# Altium project Sensor.PrjPcb
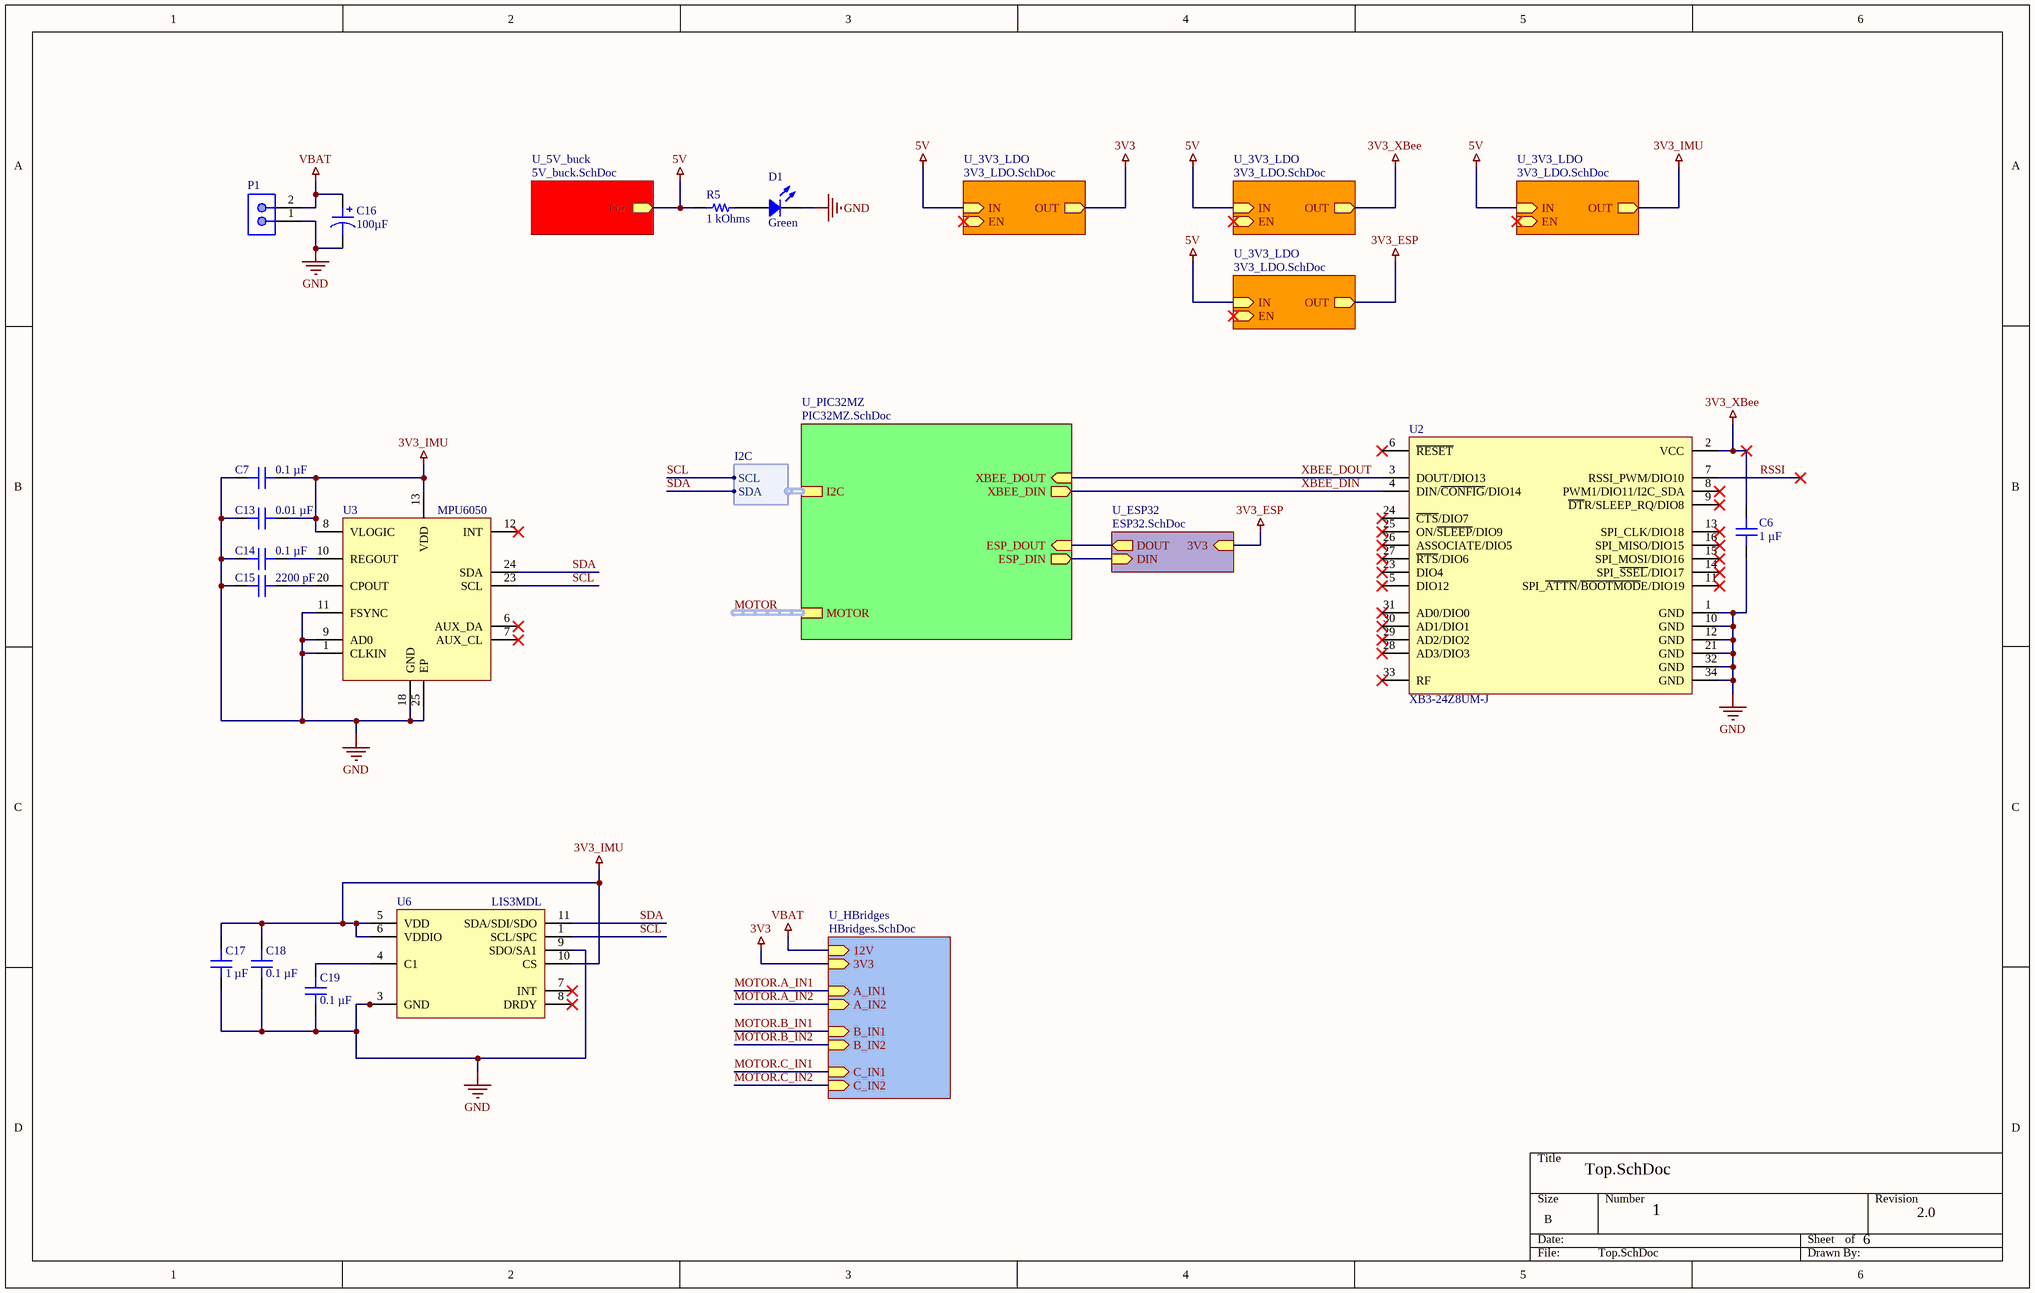
[diagram p0: Top.SchDoc]
ProjectRevision: 2.0
6 sheets, 98 parts. Net scope: hierarchical (ports join the sheet entries above them; power ports are global).
Board file: Sensor.PcbDoc
Sheets:
  Top.SchDoc
    U_PIC32MZ = PIC32MZ.SchDoc
    U_5V_buck = 5V_buck.SchDoc
    U_3V3_LDO = 3V3_LDO.SchDoc
    U_3V3_LDO = 3V3_LDO.SchDoc
    U_3V3_LDO = 3V3_LDO.SchDoc
    U_3V3_LDO = 3V3_LDO.SchDoc
    U_HBridges = HBridges.SchDoc
    U_ESP32 = ESP32.SchDoc

## Sheet Top.SchDoc
size B; SheetNumber: 1; SheetTotal: 6

### Parts
C6  1 µF  [CAP 0402_1005]
C7  0.1 µF  [CAP 0402_1005]
C13  0.01 µF  [CAP 0402_1005]
C14  0.1 µF  [CAP 0402_1005]
C15  2200 pF  [CAP 0402_1005]
C16  100µF  [CAP POL 2917_7343]
C17  1 µF  [CAP 0402_1005]
C18  0.1 µF  [CAP 0402_1005]
C19  0.1 µF  [CAP 0402_1005]
D1  Green  [LED 0603_1608 GREEN]
P1  2 pin 2mm JST Male  [2pin - 2mm JST male]  (value not drawn)
R5  1 kOhms  [YAGEO RES 0402_1005]
U2  XB3-24Z8UM-J  [XCVR_XB3-24Z8UM-J]
U3  MPU6050  [IC_MPU6050]
U6  LIS3MDL  [LGA12_ST]

### Sub-sheets
U_3V3_LDO = 3V3_LDO.SchDoc: OUT (out), IN (in), EN (in)
U_3V3_LDO = 3V3_LDO.SchDoc: OUT (out), IN (in), EN (in)
U_3V3_LDO = 3V3_LDO.SchDoc: OUT (out), IN (in), EN (in)
U_3V3_LDO = 3V3_LDO.SchDoc: OUT (out), IN (in), EN (in)
U_5V_buck = 5V_buck.SchDoc: Out (out)
U_ESP32 = ESP32.SchDoc: 3V3 (in), DOUT (out), DIN (in)
U_HBridges = HBridges.SchDoc: A_IN1 (in), A_IN2 (in), B_IN1 (in), B_IN2 (in), C_IN1 (in), C_IN2 (in), 3V3 (in), 12V (in)
U_PIC32MZ = PIC32MZ.SchDoc: XBEE_DIN (out), XBEE_DOUT (in), I2C (harness I2C), MOTOR (harness MOTOR), ESP_DIN (out), ESP_DOUT (in)

### Harnesses
I2C: SCL, SDA

### Nets
3V3: sheet U_3V3_LDO/OUT, sheet U_HBridges/3V3
3V3_ESP: sheet U_3V3_LDO/OUT, sheet U_ESP32/3V3
3V3_IMU: C7.1 C13.1 C17.1 C18.1 U3.8(VLOGIC) U3.13(VDD) U6.5(VDD) U6.6(VDDIO) U6.10(CS) ; sheet U_3V3_LDO/OUT
3V3_XBee: C6.1 U2.2(VCC) ; sheet U_3V3_LDO/OUT
5V: R5.1 ; sheet U_5V_buck/Out, sheet U_3V3_LDO/IN, sheet U_3V3_LDO/IN, sheet U_3V3_LDO/IN, sheet U_3V3_LDO/IN
GND: C6.2 C7.2 C13.2 C14.2 C15.2 C16.2 C17.2 C18.2 C19.2 D1.2 P1.1 U2.1(GND) U2.10(GND) U2.12(GND) U2.21(GND) U2.32(GND) U2.34(GND) U3.1(CLKIN) U3.9(AD0) U3.11(FSYNC) U3.18(GND) U3.25(EP) U6.2(Reserved) U6.3(GND) U6.9(SDO/SA1) U6.12(Reserved)
VBAT: C16.1 P1.2 ; sheet U_HBridges/12V
ESP_DIN: sheet U_PIC32MZ/ESP_DIN, sheet U_ESP32/DIN
ESP_DOUT: sheet U_PIC32MZ/ESP_DOUT, sheet U_ESP32/DOUT
RSSI: U2.7(RSSI_PWM/DIO10)
SCL: U3.23(SCL) U6.1(SCL/SPC) ; sheet U_PIC32MZ/I2C.SCL
SDA: U3.24(SDA) U6.11(SDA/SDI/SDO) ; sheet U_PIC32MZ/I2C.SDA
XBEE_DIN: U2.4(DIN/~{CONFIG}/DIO14) ; sheet U_PIC32MZ/XBEE_DIN
XBEE_DOUT: U2.3(DOUT/DIO13) ; sheet U_PIC32MZ/XBEE_DOUT
NetC14_1: C14.1 U3.10(REGOUT)
NetC15_1: C15.1 U3.20(CPOUT)
NetC19_1: C19.1 U6.4(C1)
NetD1_1: D1.1 R5.2

Not connected (* = marked no-connect by the designer): U2 5(DIO12)* 6(~{RESET})* 8(PWM1/DIO11/I2C_SDA)* 9(~{DT}R/SLEEP_RQ/DIO8)* 11(SPI_~{ATTN}/~{BOOTMOD}E/DIO19)* 13(SPI_CLK/DIO18)* 14(SPI_~{SSEL}/DIO17)* 15(SPI_MOSI/DIO16)* 16(SPI_MISO/DIO15)* 23(DIO4)* 24(~{CTS}/DIO7)* 25(ON/~{SLEEP}/DIO9)* 26(ASSOCIATE/DIO5)* 27(~{RTS}/DIO6)* 28(AD3/DIO3)* 29(AD2/DIO2)* 30(AD1/DIO1)* 31(AD0/DIO0)* 33(RF)*; U3 6(AUX_DA)* 7(AUX_CL)* 12(INT)*; U6 7(INT)* 8(DRDY)*

### Buses and harness runs
harness MOTOR = sheet U_PIC32MZ/MOTOR

### Library data of the parts
C6 C13 C15 C17 = C0402C104K4RACAUTO: CAP CER 0.1UF 16V X7R 0402; manufacturer: KEMET; Capacitance: 0.1 µF; Tolerance: ±10%; Part Number: C0402C104K4RACAUTO; Applications: Automotive, Bypass, Decoupling; componentlink1description: Datasheet; componentlink1url: https://api.kemet.com/component-edge/download/specsheet/C0402C104K4RACAUTO.pdf; componentlink2description: DigiKey Link; componentlink2url: https://www.digikey.com/en/products/detail/kemet/C0402C104K4RACAUTO/3314827; Device Package: 0402 (1005 Metric); lastupdated: 8/14/2022 9:05:51 PM; Lifecycle Status: Active; Minimum Order: 1; Mounting Type: Surface Mount, MLCC; Operating Temperature: -55°C ~ 125°C; Package / Case: 0402 (1005 Metric); packaging: TapeAndReel; partid: 3024; Part Status: Active; price: 0.01; Ratings: AEC-Q200; series: SMD Auto X7R; Size / Dimension: 0.039" L x 0.020" W (1.00mm x 0.50mm); Supplier 1: DigiKey; Supplier Part Number 1: 399-6828-1-ND; Temperature Coefficient: X7R; Thickness (Max): 0.022" (0.55mm); Voltage - Rated: 16V
  C6 C17: Value: 1 µF
  C13: Value: 0.01 µF
  C15: Value: 2200 pF
C7 C14 C18 C19 = C0402C104K4RACAUTO: CAP CER 0.1UF 16V X7R 0402; manufacturer: KEMET; Tolerance: ±10%; Part Number: C0402C104K4RACAUTO; Value: 0.1 µF; Applications: Automotive, Bypass, Decoupling; Capacitance: 0.1 µF; componentlink1description: Datasheet; componentlink1url: https://api.kemet.com/component-edge/download/specsheet/C0402C104K4RACAUTO.pdf; componentlink2description: DigiKey Link; componentlink2url: https://www.digikey.com/en/products/detail/kemet/C0402C104K4RACAUTO/3314827; Device Package: 0402 (1005 Metric); lastupdated: 8/14/2022 9:05:51 PM; Lifecycle Status: Active; Minimum Order: 1; Mounting Type: Surface Mount, MLCC; Operating Temperature: -55°C ~ 125°C; Package / Case: 0402 (1005 Metric); packaging: TapeAndReel; partid: 3024; Part Status: Active; price: 0.01; Ratings: AEC-Q200; series: SMD Auto X7R; Size / Dimension: 0.039" L x 0.020" W (1.00mm x 0.50mm); Supplier 1: DigiKey; Supplier Part Number 1: 399-6828-1-ND; Temperature Coefficient: X7R; Thickness (Max): 0.022" (0.55mm); Voltage - Rated: 16V
C16 = 293D107X0020E2TE3: CAP TANT 100UF 20% 20V 2917; Manufacturer: Vishay Sprague; Manufacturer Size Code: E; ESR (Equivalent Series Resistance): 500mOhm; Type: Molded; Part Number: 293D107X0020E2TE3; Value: 100µF; Capacitance: 100µF; ComponentLink1Description: Datasheet; ComponentLink1URL: http://www.vishay.com/docs/40002/293d.pdf; ComponentLink2Description: DigiKey Link; ComponentLink2URL: http://digikey.com/product-detail/en/vishay-sprague/293D107X0020E2TE3/718-293D107X0020E2TE3CT-ND/10507022; Device Package: 2917 (7343 Metric); Features: General Purpose; Height - Seated (Max): 0.170" (4.32mm); LastUpdated: 13-Aug-20 10:43:35 AM; Lifecycle Status: Active; Minimum Order: 1; Mounting Type: Surface Mount; Operating Temperature: -55°C ~ 125°C; Package / Case: 2917 (7343 Metric); Packaging: TapeAndReel; PartId: 1360; Part Status: Active; Price: 0.70; Series: TANTAMOUNT®, 293D; Size / Dimension: 0.287" L x 0.169" W (7.30mm x 4.30mm); Supplier 1: DigiKey; Supplier Part Number 1: 718-293D107X0020E2TE3CT-ND; Tolerance: ±20%
D1 = XZCDGK53W-8VF: 1.6X0.8MM LC GREEN PIXSOLED DOME; Manufacturer: SunLED; Configuration: Independent; Current - Test: 2mA; Lens Color: Colorless; Lens Size: 0.35mm Dia; Lens Style: Round with Domed Top; Lens Transparency: Clear; Millicandela Rating: 417mcd; Viewing Angle: 60°; Voltage - Forward (Vf) (Typ): 2.65V; Wavelength - Dominant: 525nm; Wavelength - Peak: 515nm; Part Number: XZCDGK53W-8VF; Color: Green; ComponentLink1Description: Datasheet; ComponentLink1URL: https://www.sunledusa.com/products/spec/XZCDGK53W-8VF.pdf; ComponentLink2Description: DigiKey Link; ComponentLink2URL: http://digikey.com/product-detail/en/sunled/XZCDGK53W-8VF/1497-XZCDGK53W-8VFCT-ND/10449792; Device Package: 0603 (1608 Metric); Height (Max): 1.10mm; LastUpdated: 21-Jan-20 3:12:09 AM; Lifecycle Status: Active; Minimum Order: 1; Mounting Type: Surface Mount; Package / Case: 0603 (1608 Metric); Packaging: Unknown; PartId: 938; Part Status: Active; Price: 0.18; Series: Ultra Low Current; Size / Dimension: 1.60mm L x 0.80mm W; Supplier 1: DigiKey; Supplier Part Number 1: 1497-XZCDGK53W-8VFCT-ND; Supplier Device Package: 2-SMD; Value: Green
R5 = RC0402FR-071KL: RES 1K OHM 1% 1/16W 0402; Manufacturer: Yageo; Power (Watts): 0.063W, 1/16W; Temperature Coefficient: ±100ppm/°C; Part Number: RC0402FR-071KL; Value: 1 kOhms; ComponentLink1Description: Datasheet; ComponentLink1URL: https://www.yageo.com/upload/media/product/productsearch/datasheet/rchip/PYu-RC_Group_51_RoHS_L_10.pdf; ComponentLink2Description: DigiKey Link; ComponentLink2URL: https://www.digikey.com/en/products/detail/yageo/RC0402FR-071KL/726513; Composition: Thick Film; Device Package: 0402 (1005 Metric); Features: Moisture Resistant; Height - Seated (Max): 0.016" (0.40mm); LastUpdated: 7/25/2024 9:18:11 AM; Lifecycle Status: Active; Minimum Order: 1; Number of Terminations: 2; Operating Temperature: -55°C ~ 155°C; Package / Case: 0402 (1005 Metric); Packaging: CutTape; PartId: 17596; Part Status: Active; Price: 0.01; Resistance: 1 kOhms; Series: RC_L; Size / Dimension: 0.039" L x 0.020" W (1.00mm x 0.50mm); Supplier 1: DigiKey; Supplier Part Number 1: 311-1.00KLRCT-ND; Supplier Device Package: 0402; Tolerance: ±1%
U2 = XB3-24Z8UM-J: 802.15.4 Zigbee Transceiver Module 2.4GHz Antenna Not Included, U.FL Surface Mount; MF: Digi International; Availability: Unavailable; MP: XB3-24Z8UM-J; Value: *; SnapEDA_Link: https://www.snapeda.com/parts/XB3-24Z8UM-J/Digi%20International/view-part/2762908/?ref=snap; Price: None; Package: SMD-34 Digi International
U6 = LIS3MDL: Magnetometer

## Sheet PIC32MZ.SchDoc
size B; DocumentNumber: 6; SheetNumber: 2; SheetTotal: 7
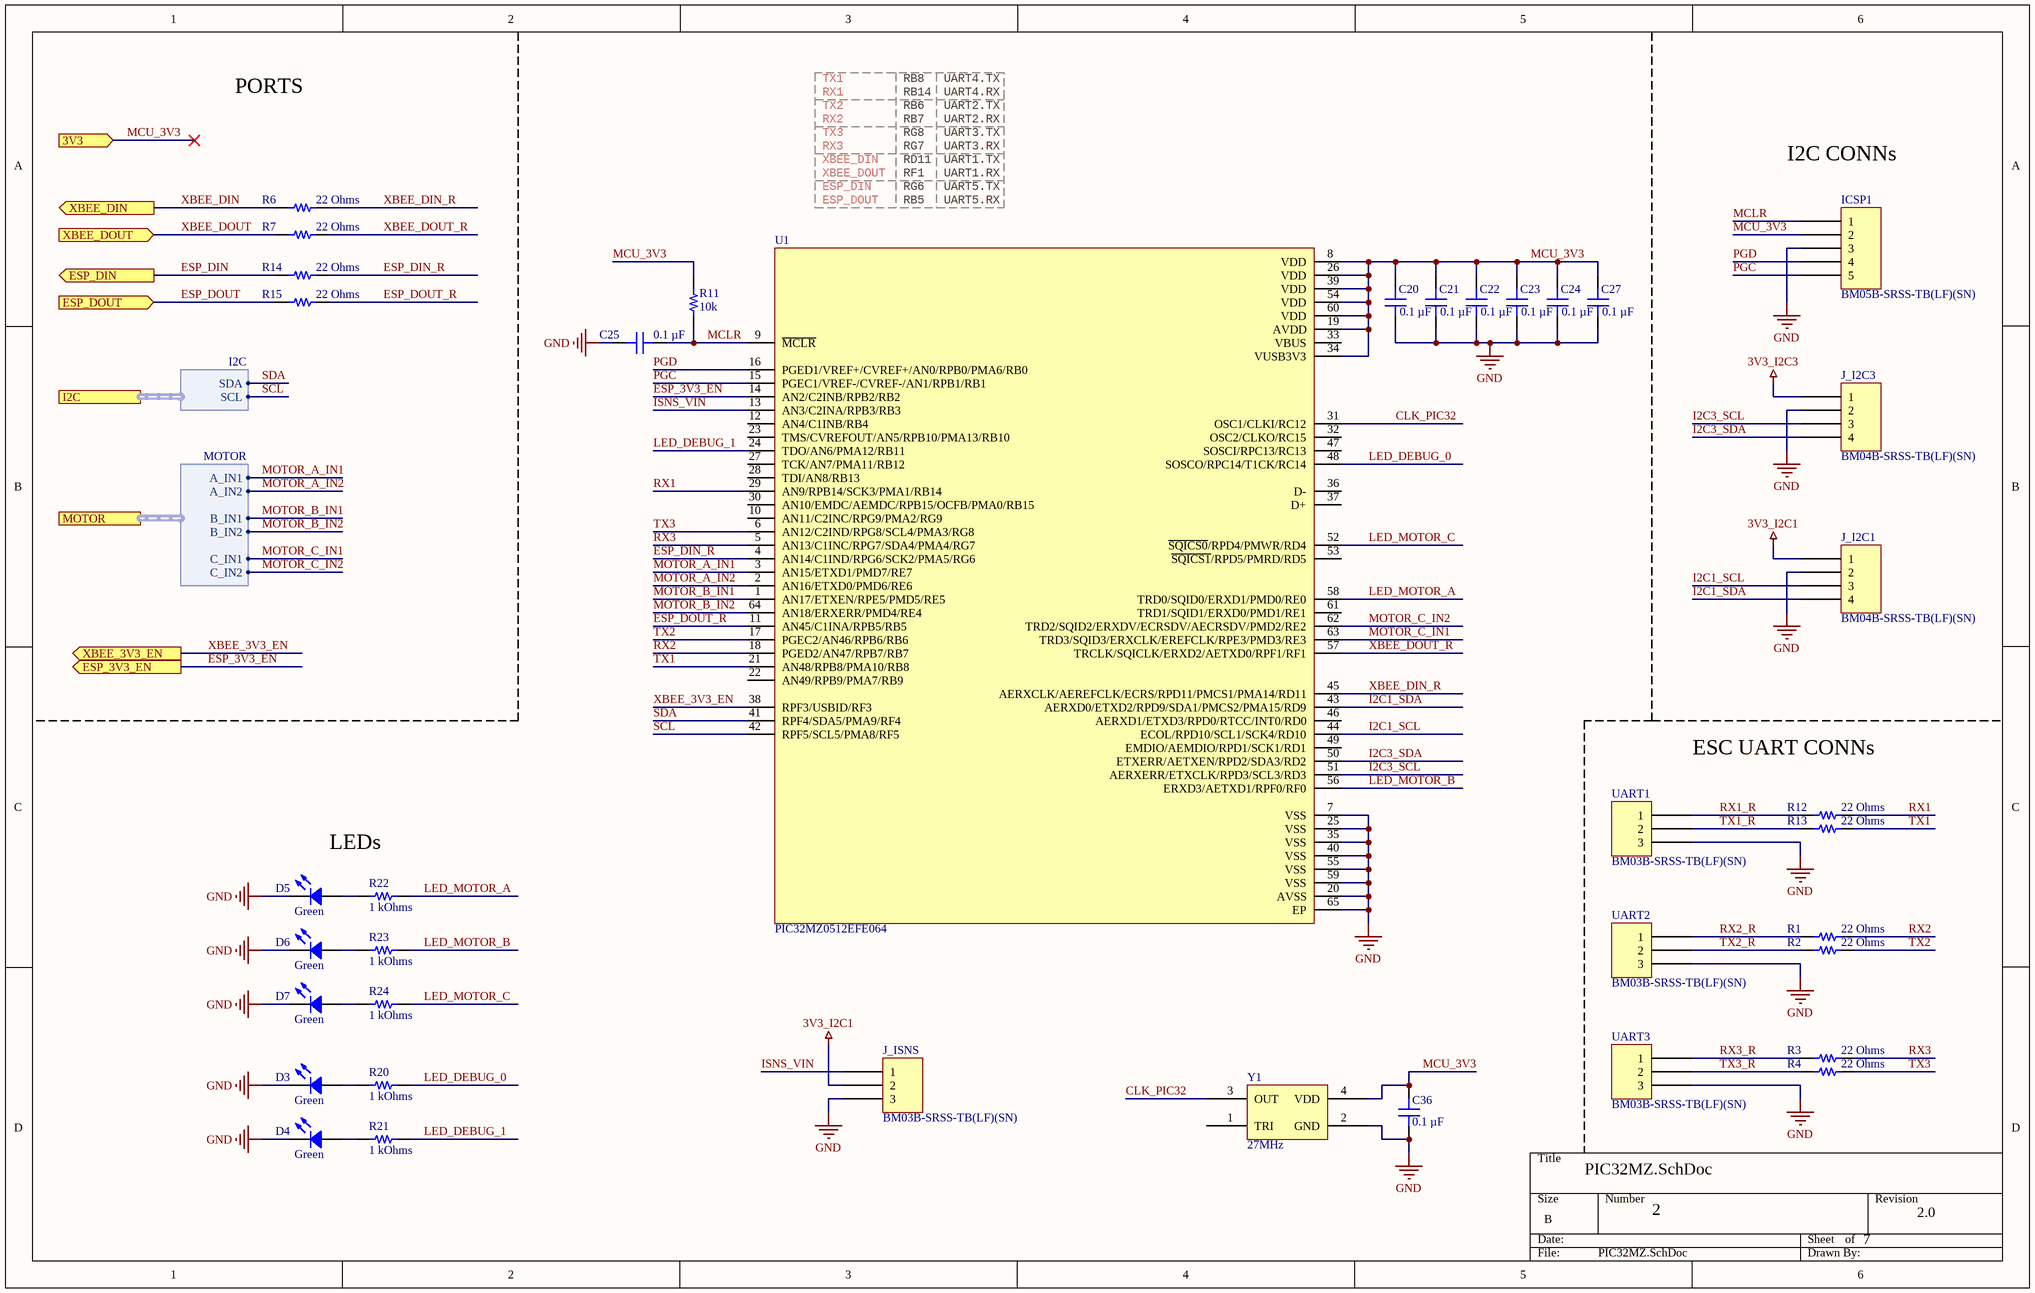
[diagram p1: PIC32MZ.SchDoc]

### Parts
C20  0.1 µF  [CAP 0402_1005]
C21  0.1 µF  [CAP 0402_1005]
C22  0.1 µF  [CAP 0402_1005]
C23  0.1 µF  [CAP 0402_1005]
C24  0.1 µF  [CAP 0402_1005]
C25  0.1 µF  [CAP 0402_1005]
C27  0.1 µF  [CAP 0402_1005]
C36  0.1 µF  [CAP 0402_1005]
D3  Green  [LED 0603_1608 GREEN]
D4  Green  [LED 0603_1608 GREEN]
D5  Green  [LED 0603_1608 GREEN]
D6  Green  [LED 0603_1608 GREEN]
D7  Green  [LED 0603_1608 GREEN]
ICSP1  BM05B-SRSS-TB(LF)(SN)  [JST BM05B-SRSS-TB]
J_I2C1  BM04B-SRSS-TB(LF)(SN)  [JST BM04B-SRSS-TB]
J_I2C3  BM04B-SRSS-TB(LF)(SN)  [JST BM04B-SRSS-TB]
J_ISNS  BM03B-SRSS-TB(LF)(SN)  [JST BM03B-SRSS-TB]
R1  22 Ohms  [RES 0402_1005]
R2  22 Ohms  [RES 0402_1005]
R3  22 Ohms  [RES 0402_1005]
R4  22 Ohms  [RES 0402_1005]
R6  22 Ohms  [RES 0402_1005]
R7  22 Ohms  [RES 0402_1005]
R11  10k  [RES 0402_1005]
R12  22 Ohms  [RES 0402_1005]
R13  22 Ohms  [RES 0402_1005]
R14  22 Ohms  [YAGEO RES 0402_1005]
R15  22 Ohms  [YAGEO RES 0402_1005]
R20  1 kOhms  [YAGEO RES 0402_1005]
R21  1 kOhms  [YAGEO RES 0402_1005]
R22  1 kOhms  [YAGEO RES 0402_1005]
R23  1 kOhms  [YAGEO RES 0402_1005]
R24  1 kOhms  [YAGEO RES 0402_1005]
U1  PIC32MZ0512EFE064  [QFN50P900X900X100-65N]
UART1  BM03B-SRSS-TB(LF)(SN)  [JST BM03B-SRSS-TB]
UART2  BM03B-SRSS-TB(LF)(SN)  [JST BM03B-SRSS-TB]
UART3  BM03B-SRSS-TB(LF)(SN)  [JST BM03B-SRSS-TB]
Y1  27MHz  [ABRACON ASD]

### Ports
3V3 (in), ESP_3V3_EN (out), ESP_DIN (out), ESP_DOUT (in), I2C (harness I2C), MOTOR (harness MOTOR), XBEE_3V3_EN (out), XBEE_DIN (out), XBEE_DOUT (in)

### Harnesses
I2C: SDA, SCL
MOTOR: A_IN1, A_IN2, B_IN1, B_IN2, C_IN1, C_IN2

### Nets
3V3_I2C1: J_I2C1.1 J_ISNS.2
3V3_I2C3: J_I2C3.1
GND: C20.1 C21.1 C22.1 C23.1 C24.1 C25.2 C27.1 C36.1 D3.2 D4.2 D5.2 D6.2 D7.2 ICSP1.3 J_I2C1.2 J_I2C3.2 J_ISNS.3 U1.7(VSS) U1.20(AVSS) U1.25(VSS) U1.35(VSS) U1.40(VSS) U1.55(VSS) U1.59(VSS) U1.65(EP) UART1.3 UART2.3 UART3.3 Y1.2(GND)
CLK_PIC32: U1.31(OSC1/CLKI/RC12) Y1.3(OUT)
ESP_3V3_EN: U1.14(AN2/C2INB/RPB2/RB2) ; port ESP_3V3_EN
ESP_DIN: R14.1 ; port ESP_DIN
ESP_DIN_R: R14.2 U1.4(AN14/C1IND/RPG6/SCK2/PMA5/RG6)
ESP_DOUT: R15.1 ; port ESP_DOUT
ESP_DOUT_R: R15.2 U1.11(AN45/C1INA/RPB5/RB5)
I2C1_SCL: J_I2C1.3 U1.44(ECOL/RPD10/SCL1/SCK4/RD10)
I2C1_SDA: J_I2C1.4 U1.43(AERXD0/ETXD2/RPD9/SDA1/PMCS2/PMA15/RD9)
I2C3_SCL: J_I2C3.3 U1.51(AERXERR/ETXCLK/RPD3/SCL3/RD3)
I2C3_SDA: J_I2C3.4 U1.50(ETXERR/AETXEN/RPD2/SDA3/RD2)
ISNS_VIN: J_ISNS.1 U1.13(AN3/C2INA/RPB3/RB3)
LED_DEBUG_0: R20.2 U1.48(SOSCO/RPC14/T1CK/RC14)
LED_DEBUG_1: R21.2 U1.24(TDO/AN6/PMA12/RB11)
LED_MOTOR_A: R22.2 U1.58(TRD0/SQID0/ERXD1/PMD0/RE0)
LED_MOTOR_B: R23.2 U1.56(ERXD3/AETXD1/RPF0/RF0)
LED_MOTOR_C: R24.2 U1.52(~{SQICS0}/RPD4/PMWR/RD4)
MCLR: C25.1 ICSP1.1 R11.2 U1.9(~{MCLR})
MCU_3V3: C20.2 C21.2 C22.2 C23.2 C24.2 C27.2 C36.2 ICSP1.2 R11.1 U1.8(VDD) U1.19(AVDD) U1.26(VDD) U1.34(VUSB3V3) U1.39(VDD) U1.54(VDD) U1.60(VDD) Y1.4(VDD) ; port 3V3
MOTOR_A_IN1: U1.3(AN15/ETXD1/PMD7/RE7) ; port MOTOR.A_IN1  [project net MOTOR.A_IN1]
MOTOR_A_IN2: U1.2(AN16/ETXD0/PMD6/RE6) ; port MOTOR.A_IN2  [project net MOTOR.A_IN2]
MOTOR_B_IN1: U1.1(AN17/ETXEN/RPE5/PMD5/RE5) ; port MOTOR.B_IN1  [project net MOTOR.B_IN1]
MOTOR_B_IN2: U1.64(AN18/ERXERR/PMD4/RE4) ; port MOTOR.B_IN2  [project net MOTOR.B_IN2]
MOTOR_C_IN1: U1.63(TRD3/SQID3/ERXCLK/EREFCLK/RPE3/PMD3/RE3) ; port MOTOR.C_IN1  [project net MOTOR.C_IN1]
MOTOR_C_IN2: U1.62(TRD2/SQID2/ERXDV/ECRSDV/AECRSDV/PMD2/RE2) ; port MOTOR.C_IN2  [project net MOTOR.C_IN2]
PGC: ICSP1.5 U1.15(PGEC1/VREF-/CVREF-/AN1/RPB1/RB1)
PGD: ICSP1.4 U1.16(PGED1/VREF+/CVREF+/AN0/RPB0/PMA6/RB0)
RX1: R12.1 U1.29(AN9/RPB14/SCK3/PMA1/RB14)
RX1_R: R12.2 UART1.1
RX2: R1.1 U1.18(PGED2/AN47/RPB7/RB7)
RX2_R: R1.2 UART2.1
RX3: R3.1 U1.5(AN13/C1INC/RPG7/SDA4/PMA4/RG7)
RX3_R: R3.2 UART3.1
SCL: U1.42(RPF5/SCL5/PMA8/RF5) ; port I2C.SCL
SDA: U1.41(RPF4/SDA5/PMA9/RF4) ; port I2C.SDA
TX1: R13.1 U1.21(AN48/RPB8/PMA10/RB8)
TX1_R: R13.2 UART1.2
TX2: R2.1 U1.17(PGEC2/AN46/RPB6/RB6)
TX2_R: R2.2 UART2.2
TX3: R4.1 U1.6(AN12/C2IND/RPG8/SCL4/PMA3/RG8)
TX3_R: R4.2 UART3.2
XBEE_3V3_EN: U1.38(RPF3/USBID/RF3) ; port XBEE_3V3_EN
XBEE_DIN: R6.2 ; port XBEE_DIN
XBEE_DIN_R: R6.1 U1.45(AERXCLK/AEREFCLK/ECRS/RPD11/PMCS1/PMA14/RD11)
XBEE_DOUT: R7.2 ; port XBEE_DOUT
XBEE_DOUT_R: R7.1 U1.57(TRCLK/SQICLK/ERXD2/AETXD0/RPF1/RF1)
NetD3_1: D3.1 R20.1
NetD4_1: D4.1 R21.1
NetD5_1: D5.1 R22.1
NetD6_1: D6.1 R23.1
NetD7_1: D7.1 R24.1

Not connected (* = marked no-connect by the designer): U1 10(AN11/C2INC/RPG9/PMA2/RG9) 12(AN4/C1INB/RB4) 22(AN49/RPB9/PMA7/RB9) 23(TMS/CVREFOUT/AN5/RPB10/PMA13/RB10) 27(TCK/AN7/PMA11/RB12) 28(TDI/AN8/RB13) 30(AN10/EMDC/AEMDC/RPB15/OCFB/PMA0/RB15) 32(OSC2/CLKO/RC15) 33(VBUS) 36(D-) 37(D+) 46(AERXD1/ETXD3/RPD0/RTCC/INT0/RD0) 47(SOSCI/RPC13/RC13) 49(EMDIO/AEMDIO/RPD1/SCK1/RD1) 53(~{SQICS1}/RPD5/PMRD/RD5) 61(TRD1/SQID1/ERXD0/PMD1/RE1); Y1 1(TRI)

### Notes on the sheet
- PORTS
- TX1
- RX1
- RB8
- RB14
- UART4.TX
- UART4.RX
- TX2
- RX2
- TX3
- RX3
- XBEE_DIN
- RB6
- RB7
- RG8
- RG7
- RD11
- UART2.TX
- UART3.TX
- UART1.TX
- UART2.RX
- UART3.RX
- I2C CONNs
- XBEE_DOUT
- ESP_DIN
- ESP_DOUT
- RF1
- RB5
- RG6
- UART5.TX
- UART1.RX
- UART5.RX
- ESC UART CONNs
- LEDs

### Library data of the parts
C20-C25 C27 C36 = C0402C104K4RACAUTO: as C7 on sheet Top; Part Number: C0402C104K4RACAUTO; Value: 0.1 µF; Applications: Automotive, Bypass, Decoupling; Capacitance: 0.1 µF; componentlink1description: Datasheet; componentlink1url: https://api.kemet.com/component-edge/download/specsheet/C0402C104K4RACAUTO.pdf; componentlink2description: DigiKey Link; componentlink2url: https://www.digikey.com/en/products/detail/kemet/C0402C104K4RACAUTO/3314827; Device Package: 0402 (1005 Metric); Lifecycle Status: Active; Minimum Order: 1; Mounting Type: Surface Mount, MLCC; Operating Temperature: -55°C ~ 125°C; Package / Case: 0402 (1005 Metric); packaging: TapeAndReel; partid: 3024; Part Status: Active; price: 0.01; Ratings: AEC-Q200; series: SMD Auto X7R; Size / Dimension: 0.039" L x 0.020" W (1.00mm x 0.50mm); Supplier 1: DigiKey; Supplier Part Number 1: 399-6828-1-ND; Temperature Coefficient: X7R; Thickness (Max): 0.022" (0.55mm); Voltage - Rated: 16V
  C20-C25 C27: lastupdated: 8/14/2022 9:05:51 PM
  C36: lastupdated: 2/9/2024 8:04:35 PM
D3-D7 = XZCDGK53W-8VF: as D1 on sheet Top; Part Number: XZCDGK53W-8VF; Color: Green; ComponentLink1Description: Datasheet; ComponentLink1URL: https://www.sunledusa.com/products/spec/XZCDGK53W-8VF.pdf; ComponentLink2Description: DigiKey Link; ComponentLink2URL: http://digikey.com/product-detail/en/sunled/XZCDGK53W-8VF/1497-XZCDGK53W-8VFCT-ND/10449792; Device Package: 0603 (1608 Metric); Height (Max): 1.10mm; LastUpdated: 21-Jan-20 3:12:09 AM; Lifecycle Status: Active; Minimum Order: 1; Mounting Type: Surface Mount; Package / Case: 0603 (1608 Metric); Packaging: Unknown; PartId: 938; Part Status: Active; Price: 0.18; Series: Ultra Low Current; Size / Dimension: 1.60mm L x 0.80mm W; Supplier 1: DigiKey; Supplier Part Number 1: 1497-XZCDGK53W-8VFCT-ND; Supplier Device Package: 2-SMD; Value: Green
ICSP1 = BM05B-SRSS-TB(LF)(SN): CONN HEADER SMD 5POS 1MM; Manufacturer: JST Sales America Inc.; Current Rating (Amps): 0.7A; Material Flammability Rating: UL94 V-0; Number of Positions: 5; Number of Positions Loaded: All; Pitch - Mating: 0.039" (1.00mm); Shrouding: Shrouded - 4 Wall; Style: Board to Cable/Wire; Voltage Rating: 50V; Part Number: BM05B-SRSS-TB(LF)(SN); ComponentLink1Description: Datasheet; ComponentLink1URL: http://www.jst-mfg.com/product/pdf/eng/eSR.pdf; ComponentLink2Description: DigiKey Link; ComponentLink2URL: http://digikey.com/product-detail/en/jst-sales-america-inc/BM05B-SRSS-TB-LF-SN/455-1791-1-ND/926862; Connector Type: Header; Contact Finish - Mating: Tin; Contact Finish - Post: Tin; Contact Material: Copper Alloy; Contact Shape: Square; Contact Type: Male Pin; Fastening Type: Push-Pull; Features: Solder Retention; Insulation Color: Natural; Insulation Height: 0.167" (4.25mm); Insulation Material: Polyamide (PA), Nylon; LastUpdated: 1/12/2020 10:14:00 PM; Lifecycle Status: Active; Minimum Order: 1; Mounting Type: Surface Mount; Number of Rows: 1; Operating Temperature: -25°C ~ 85°C; Packaging: TapeAndReel; PartId: 18; Part Status: Active; Price: 0.35; Series: SR; Supplier 1: DigiKey; Supplier Part Number 1: 455-1791-1-ND; Termination: Solder
J_I2C1 J_I2C3 = BM04B-SRSS-TB(LF)(SN): CONN HEADER SMD 4POS 1MM; Manufacturer: JST Sales America Inc.; Current Rating (Amps): 0.7A; Material Flammability Rating: UL94 V-0; Number of Positions: 4; Number of Positions Loaded: All; Pitch - Mating: 0.039" (1.00mm); Row Spacing - Mating: -25°C ~ 85°C; Shrouding: Shrouded - 4 Wall; Style: Board to Cable/Wire; Voltage Rating: 50V; Part Number: BM04B-SRSS-TB(LF)(SN); ComponentLink1Description: Datasheet; ComponentLink1URL: http://www.jst-mfg.com/product/pdf/eng/eSH.pdf; ComponentLink2Description: DigiKey Link; ComponentLink2URL: http://digikey.com/product-detail/en/jst-sales-america-inc/BM04B-SRSS-TB-LF-SN/455-1790-1-ND/926861; Connector Type: Header; Contact Finish - Mating: Tin; Contact Finish - Post: Tin; Contact Material: Copper Alloy; Contact Shape: Square; Contact Type: Male Pin; Fastening Type: Push-Pull; Features: Solder Retention; Insulation Color: Natural; Insulation Height: 0.167" (4.25mm); Insulation Material: Polyamide (PA), Nylon; LastUpdated: 8/24/2020 1:45:53 PM; Lifecycle Status: Active; Minimum Order: 1; Mounting Type: Surface Mount; Number of Rows: 1; Operating Temperature: -25°C ~ 85°C; Packaging: TapeAndReel; PartId: 16; Part Status: Active; Price: 0.29; Series: SR; Supplier 1: DigiKey; Supplier Part Number 1: 455-1790-1-ND; Termination: Solder
J_ISNS UART1-UART3 = BM03B-SRSS-TB(LF)(SN): CONN HEADER SMD 3POS 1MM; Manufacturer: JST Sales America Inc.; Current Rating (Amps): 0.7A; Material Flammability Rating: UL94 V-0; Number of Positions: 3; Number of Positions Loaded: All; Pitch - Mating: 0.039" (1.00mm); Shrouding: Shrouded - 4 Wall; Style: Board to Cable/Wire; Voltage Rating: 50V; Part Number: BM03B-SRSS-TB(LF)(SN); ComponentLink1Description: Datasheet; ComponentLink1URL: http://www.jst-mfg.com/product/pdf/eng/eSR.pdf; ComponentLink2Description: DigiKey Link; ComponentLink2URL: http://digikey.com/product-detail/en/jst-sales-america-inc/BM03B-SRSS-TB-LF-SN/455-1789-1-ND/926860; Connector Type: Header; Contact Finish - Mating: Tin; Contact Finish - Post: Tin; Contact Material: Copper Alloy; Contact Shape: Square; Contact Type: Male Pin; Fastening Type: Push-Pull; Features: Solder Retention; Insulation Color: Natural; Insulation Height: 0.167" (4.25mm); Insulation Material: Polyamide (PA), Nylon; LastUpdated: 1/12/2020 10:12:14 PM; Lifecycle Status: Active; Minimum Order: 1; Mounting Type: Surface Mount; Number of Rows: 1; Operating Temperature: -25°C ~ 85°C; Packaging: TapeAndReel; PartId: 14; Part Status: Active; Price: 0.24; Series: SR; Supplier 1: DigiKey; Supplier Part Number 1: 455-1789-1-ND; Termination: Solder
R1-R4 R6 R7 R11-R13 = RK73H1ETTP1432F: RES 14.3K OHM 1% 1/10W 0402; Manufacturer: KOA Speer Electronics, Inc.; Power (Watts): 0.1W, 1/10W; Resistance: 14.3 kOhms; Temperature Coefficient: ±100ppm/°C; Part Number: RK73H1ETTP1432F; ComponentLink1Description: Datasheet; ComponentLink1URL: http://www.koaspeer.com/catimages/Products/RK73H/RK73H.pdf; ComponentLink2Description: DigiKey Link; ComponentLink2URL: https://www.digikey.com/en/products/detail/koa-speer-electronics-inc/RK73H1ETTP1432F/9844351; Composition: Thick Film; Device Package: 0402 (1005 Metric); Features: Automotive AEC-Q200, Moisture Resistant; Height - Seated (Max): 0.016" (0.40mm); LastUpdated: 8/14/2022 9:23:49 PM; Lifecycle Status: Active; Minimum Order: 1; Number of Terminations: 2; Operating Temperature: -55°C ~ 155°C; Package / Case: 0402 (1005 Metric); Packaging: CutTape; PartId: 10193; Part Status: Active; Price: 0.01; Ratings: AEC-Q200; Series: RK73H; Size / Dimension: 0.039" L x 0.020" W (1.00mm x 0.50mm); Supplier 1: DigiKey; Supplier Part Number 1: 2019-RK73H1ETTP1432FCT-ND; Supplier Device Package: 0402; Tolerance: ±1%
  R1-R4 R6 R7 R12 R13: Value: 22 Ohms
  R11: Value: 10k
R14 R15 = RC0402FR-071KL: RES 1K OHM 1% 1/16W 0402; Manufacturer: Yageo; Power (Watts): 0.063W, 1/16W; Resistance: 1 kOhms; Temperature Coefficient: ±100ppm/°C; Part Number: RC0402FR-071KL; Value: 22 Ohms; ComponentLink1Description: Datasheet; ComponentLink1URL: https://www.yageo.com/upload/media/product/productsearch/datasheet/rchip/PYu-RC_Group_51_RoHS_L_10.pdf; ComponentLink2Description: DigiKey Link; ComponentLink2URL: https://www.digikey.com/en/products/detail/yageo/RC0402FR-071KL/726513; Composition: Thick Film; Device Package: 0402 (1005 Metric); Features: Moisture Resistant; Height - Seated (Max): 0.016" (0.40mm); LastUpdated: 7/25/2024 9:18:11 AM; Lifecycle Status: Active; Minimum Order: 1; Number of Terminations: 2; Operating Temperature: -55°C ~ 155°C; Package / Case: 0402 (1005 Metric); Packaging: CutTape; PartId: 17596; Part Status: Active; Price: 0.01; Series: RC_L; Size / Dimension: 0.039" L x 0.020" W (1.00mm x 0.50mm); Supplier 1: DigiKey; Supplier Part Number 1: 311-1.00KLRCT-ND; Supplier Device Package: 0402; Tolerance: ±1%
R20-R24 = RC0402FR-071KL: as R5 on sheet Top; Part Number: RC0402FR-071KL; Value: 1 kOhms; ComponentLink1Description: Datasheet; ComponentLink1URL: https://www.yageo.com/upload/media/product/productsearch/datasheet/rchip/PYu-RC_Group_51_RoHS_L_10.pdf; ComponentLink2Description: DigiKey Link; ComponentLink2URL: https://www.digikey.com/en/products/detail/yageo/RC0402FR-071KL/726513; Composition: Thick Film; Device Package: 0402 (1005 Metric); Features: Moisture Resistant; Height - Seated (Max): 0.016" (0.40mm); LastUpdated: 7/25/2024 9:18:11 AM; Lifecycle Status: Active; Minimum Order: 1; Number of Terminations: 2; Operating Temperature: -55°C ~ 155°C; Package / Case: 0402 (1005 Metric); Packaging: CutTape; PartId: 17596; Part Status: Active; Price: 0.01; Resistance: 1 kOhms; Series: RC_L; Size / Dimension: 0.039" L x 0.020" W (1.00mm x 0.50mm); Supplier 1: DigiKey; Supplier Part Number 1: 311-1.00KLRCT-ND; Supplier Device Package: 0402; Tolerance: ±1%
U1 = PIC32MZ0512EFE064-I/PT: 32-bit Microcontrollers - MCU 32-BIT MCU 512KB FL 128KB RAM, No Crypto; MF: Microchip; MP: PIC32MZ2048EFG064T-I/PT; Price: None; Value: *; SnapEDA_Link: https://www.snapeda.com/parts/PIC32MZ2048EFG064T-I/PT/Microchip/view-part/565997/?ref=snap; Package: TQFP-64 Microchip; Availability: Unavailable
Y1 = ASD3-27.000MHZ-EC-T: XTAL OSC XO 27.0000MHZ HCMOS SMD; Manufacturer: Abracon LLC; Base Resonator: Crystal; Current - Supply (Max): 4mA; Frequency Stability: ±50ppm; Function: Enable/Disable; Voltage - Supply: 1.8V; Part Number: ASD3-27.000MHZ-EC-T; ComponentLink1Description: Datasheet; ComponentLink1URL: https://abracon.com/Oscillators/ASDseries.pdf; ComponentLink2Description: DigiKey Link; ComponentLink2URL: http://digikey.com/product-detail/en/abracon-llc/ASD3-27.000MHZ-EC-T/535-9608-1-ND/1237075; Frequency: 27MHz; Height - Seated (Max): 0.039" (1.00mm); LastUpdated: 6/3/2024 8:02:05 PM; Lifecycle Status: Active; Minimum Order: 1; Mounting Type: Surface Mount; Operating Temperature: -20°C ~ 70°C; Output: HCMOS; Package / Case: 4-SMD, No Lead; Packaging: TapeAndReel; PartId: 4; Part Status: Active; Price: 1.74; Series: ASD; Size / Dimension: 0.098" L x 0.079" W (2.50mm x 2.00mm); Supplier 1: DigiKey; Supplier Part Number 1: 535-9608-1-ND; Type: XO (Standard); Value: 27MHz

## Sheet 5V_buck.SchDoc
size B; SheetNumber: 4; SheetTotal: 5
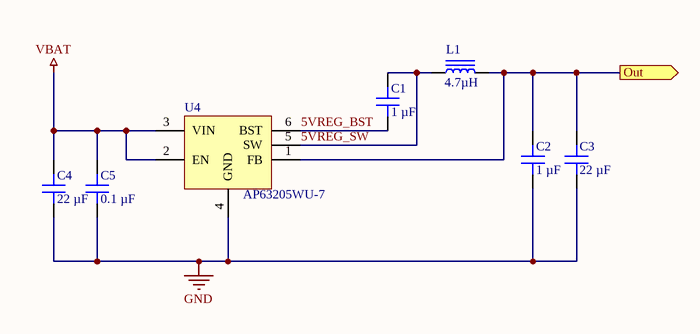
[diagram p2: 5V_buck.SchDoc]

### Parts
C1  1 µF  [CAP 0402_1005]
C2  1 µF  [CAP 0402_1005]
C3  22 µF  [CAP 0402_1005]
C4  22 µF  [CAP 0603_1608]
C5  0.1 µF  [CAP 0402_1005]
L1  4.7µH  [IND 1008_2520]
U4  AP63205WU-7  [TSOT-26-6 - 3.2mm]

### Ports
Out (out)

### Nets
5V: C2.2 C3.2 L1.2 U4.1(FB) ; port Out
GND: C2.1 C3.1 C4.1 C5.1 U4.4(GND)
VBAT: C4.2 C5.2 U4.2(EN) U4.3(VIN)
5VREG_BST: C1.1 U4.6(BST)
5VREG_SW: C1.2 L1.1 U4.5(SW)

### Library data of the parts
C1-C3 = C0402C104K4RACAUTO: as C6 on sheet Top; Part Number: C0402C104K4RACAUTO; Applications: Automotive, Bypass, Decoupling; componentlink1description: Datasheet; componentlink1url: https://api.kemet.com/component-edge/download/specsheet/C0402C104K4RACAUTO.pdf; componentlink2description: DigiKey Link; componentlink2url: https://www.digikey.com/en/products/detail/kemet/C0402C104K4RACAUTO/3314827; Device Package: 0402 (1005 Metric); lastupdated: 8/14/2022 9:05:51 PM; Lifecycle Status: Active; Minimum Order: 1; Mounting Type: Surface Mount, MLCC; Operating Temperature: -55°C ~ 125°C; Package / Case: 0402 (1005 Metric); packaging: TapeAndReel; partid: 3024; Part Status: Active; price: 0.01; Ratings: AEC-Q200; series: SMD Auto X7R; Size / Dimension: 0.039" L x 0.020" W (1.00mm x 0.50mm); Supplier 1: DigiKey; Supplier Part Number 1: 399-6828-1-ND; Temperature Coefficient: X7R; Thickness (Max): 0.022" (0.55mm); Voltage - Rated: 16V
  C1 C2: Value: 1 µF
  C3: Value: 22 µF
C4 = C0603B476M007T: CAP CER 47UF 6.3V X5R 0603; manufacturer: Holy Stone Enterprise Co., Ltd.; Capacitance: 47 µF; Tolerance: ±20%; Part Number: C0603B476M007T; Value: 22 µF; Applications: SMPS Filtering; componentlink1description: Datasheet; componentlink1url: https://media.digikey.com/pdf/Data%20Sheets/Holy%20Stone/HCC_Series_DS.pdf; componentlink2description: DigiKey Link; componentlink2url: https://www.digikey.com/en/products/detail/holy-stone-enterprise-co-ltd/C0603B476M007T/16895203; Device Package: 0603 (1608 Metric); lastupdated: 2/9/2024 8:09:41 PM; Lifecycle Status: Active; Minimum Order: 1; Mounting Type: Surface Mount, MLCC; Operating Temperature: -55°C ~ 85°C; Package / Case: 0603 (1608 Metric); packaging: TapeAndReel; partid: 48531; Part Status: Active; price: 0.12; series: HCC; Size / Dimension: 0.063" L x 0.031" W (1.60mm x 0.80mm); Supplier 1: DigiKey; Supplier Part Number 1: 4587-C0603B476M007TCT-ND; Temperature Coefficient: X5R; Thickness (Max): 0.039" (1.00mm); Voltage - Rated: 6.3V
C5 = C0402C104K4RACAUTO: as C7 on sheet Top; Part Number: C0402C104K4RACAUTO; Value: 0.1 µF; Applications: Automotive, Bypass, Decoupling; Capacitance: 0.1 µF; componentlink1description: Datasheet; componentlink1url: https://api.kemet.com/component-edge/download/specsheet/C0402C104K4RACAUTO.pdf; componentlink2description: DigiKey Link; componentlink2url: https://www.digikey.com/en/products/detail/kemet/C0402C104K4RACAUTO/3314827; Device Package: 0402 (1005 Metric); lastupdated: 8/14/2022 9:05:51 PM; Lifecycle Status: Active; Minimum Order: 1; Mounting Type: Surface Mount, MLCC; Operating Temperature: -55°C ~ 125°C; Package / Case: 0402 (1005 Metric); packaging: TapeAndReel; partid: 3024; Part Status: Active; price: 0.01; Ratings: AEC-Q200; series: SMD Auto X7R; Size / Dimension: 0.039" L x 0.020" W (1.00mm x 0.50mm); Supplier 1: DigiKey; Supplier Part Number 1: 399-6828-1-ND; Temperature Coefficient: X7R; Thickness (Max): 0.022" (0.55mm); Voltage - Rated: 16V
L1 = MLP2520S4R7ST0S1: FIXED IND 4.7UH 1A 110 MOHM SMD; Manufacturer: TDK Corporation; DC Resistance (DCR): 143mOhm Max; Inductance Frequency - Test: 2MHz; Material - Core: Ferrite; Shielding: Shielded; Tolerance: ±20%; Type: Multilayer; Part Number: MLP2520S4R7ST0S1; ComponentLink1Description: Datasheet; ComponentLink1URL: https://product.tdk.com/info/en/catalog/datasheets/inductor_commercial_power_mlp2520_en.pdf?ref_disty=digikey; ComponentLink2Description: DigiKey Link; ComponentLink2URL: http://digikey.com/product-detail/en/tdk-corporation/MLP2520S4R7ST0S1/445-6378-1-ND/2465705; Current Rating (Amps): 1A; Device Package: 1008 (2520 Metric); Height - Seated (Max): 0.039" (1.00mm); Inductance: 4.7µH; LastUpdated: 13-Aug-20 11:03:40 AM; Lifecycle Status: Active; Minimum Order: 1; Mounting Type: Surface Mount; Operating Temperature: -40°C ~ 125°C; Package / Case: 1008 (2520 Metric); Packaging: TapeAndReel; PartId: 3467; Part Status: Active; Price: 0.14; Series: MLP; Size / Dimension: 0.098" L x 0.079" W (2.50mm x 2.00mm); Supplier 1: DigiKey; Supplier Part Number 1: 445-6378-1-ND; Supplier Device Package: 1008 (2520 Metric); Value: 4.7µH
U4 = AP63205WU-7: 5V fixed step down Buck

## Sheet 3V3_LDO.SchDoc
size B; DocumentNumber: 2; SheetNumber: 3; SheetTotal: 7
Used 4 times, as channels U_3V3_LDO, U_3V3_LDO, U_3V3_LDO, U_3V3_LDO. Parts and nets are listed once, with the designators drawn on the sheet.
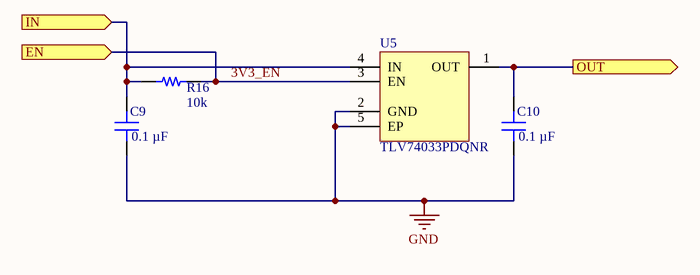
[diagram p3: 3V3_LDO.SchDoc]

### Parts
C9  0.1 µF  [CAP 0402_1005]
C10  0.1 µF  [CAP 0402_1005]
R16  10k  [RES 0402_1005]
U5  TLV74033PDQNR  [XDFN-4]

### Ports
EN (in), IN (in), OUT (out)

### Nets
GND: C9.1 C10.1 U5.2(GND) U5.5(EP)
3V3_EN: R16.2 U5.3(EN) ; port EN
IN: C9.2 R16.1 U5.4(IN) ; port IN
OUT: C10.2 U5.1(OUT) ; port OUT

### Channels
U_3V3_LDO: designators C9=C9_4 C10=C10_4 R16=R16_4 U5=U5_1; ports EN=3V3_EN_U_3V3_LDO IN=5V OUT=3V3
U_3V3_LDO: designators C9=C9_3 C10=C10_3 R16=R16_3 U5=U5_2; ports EN=3V3_EN_U_3V3_LDO IN=5V OUT=3V3_XBee
U_3V3_LDO: designators C9=C9_2 C10=C10_2 R16=R16_2 U5=U5_3; ports EN=3V3_EN_U_3V3_LDO IN=5V OUT=3V3_IMU
U_3V3_LDO: designators C9=C9_1 C10=C10_1 R16=R16_1 U5=U5_4; ports EN=3V3_EN_U_3V3_LDO IN=5V OUT=3V3_ESP

### Library data of the parts
C9 C10 = C0402C104K4RACAUTO: as C7 on sheet Top; Part Number: C0402C104K4RACAUTO; Value: 0.1 µF; Applications: Automotive, Bypass, Decoupling; Capacitance: 0.1 µF; componentlink1description: Datasheet; componentlink1url: https://api.kemet.com/component-edge/download/specsheet/C0402C104K4RACAUTO.pdf; componentlink2description: DigiKey Link; componentlink2url: https://www.digikey.com/en/products/detail/kemet/C0402C104K4RACAUTO/3314827; Device Package: 0402 (1005 Metric); lastupdated: 8/14/2022 9:05:51 PM; Lifecycle Status: Active; Minimum Order: 1; Mounting Type: Surface Mount, MLCC; Operating Temperature: -55°C ~ 125°C; Package / Case: 0402 (1005 Metric); packaging: TapeAndReel; partid: 3024; Part Status: Active; price: 0.01; Ratings: AEC-Q200; series: SMD Auto X7R; Size / Dimension: 0.039" L x 0.020" W (1.00mm x 0.50mm); Supplier 1: DigiKey; Supplier Part Number 1: 399-6828-1-ND; Temperature Coefficient: X7R; Thickness (Max): 0.022" (0.55mm); Voltage - Rated: 16V
R16 = RP73PF1E5K62BTD: RES 5.62K OHM 0.1% 1/10W 0402; Manufacturer: TE Connectivity Passive Product; Power (Watts): 0.1W, 1/10W; Resistance: 5.62 kOhms; Temperature Coefficient: ±25ppm/°C; Part Number: RP73PF1E5K62BTD; Value: 10k; ComponentLink1Description: Datasheet; ComponentLink1URL: https://www.te.com/commerce/DocumentDelivery/DDEController?Action=srchrtrv&DocNm=1773272&DocType=DS&DocLang=English; ComponentLink2Description: DigiKey Link; ComponentLink2URL: https://www.digikey.com/en/products/detail/te-connectivity-passive-product/RP73PF1E5K62BTD/8260933; Composition: Thin Film; Device Package: 0402 (1005 Metric); Height - Seated (Max): 0.014" (0.35mm); LastUpdated: 2/9/2024 8:30:24 PM; Lifecycle Status: Active; Minimum Order: 1; Number of Terminations: 2; Operating Temperature: -55°C ~ 155°C; Package / Case: 0402 (1005 Metric); Packaging: TapeAndReel; PartId: 2425; Part Status: Active; Price: 0.08; Series: RP73, Holsworthy; Size / Dimension: 0.039" L x 0.020" W (1.00mm x 0.50mm); Supplier 1: DigiKey; Supplier Part Number 1: A127391CT-ND; Supplier Device Package: 0402; Tolerance: ±0.1%
U5 = TLV74033PDQNR: 3.3V LDO

## Sheet HBridges.SchDoc
size B; SheetNumber: 5; SheetTotal: 5
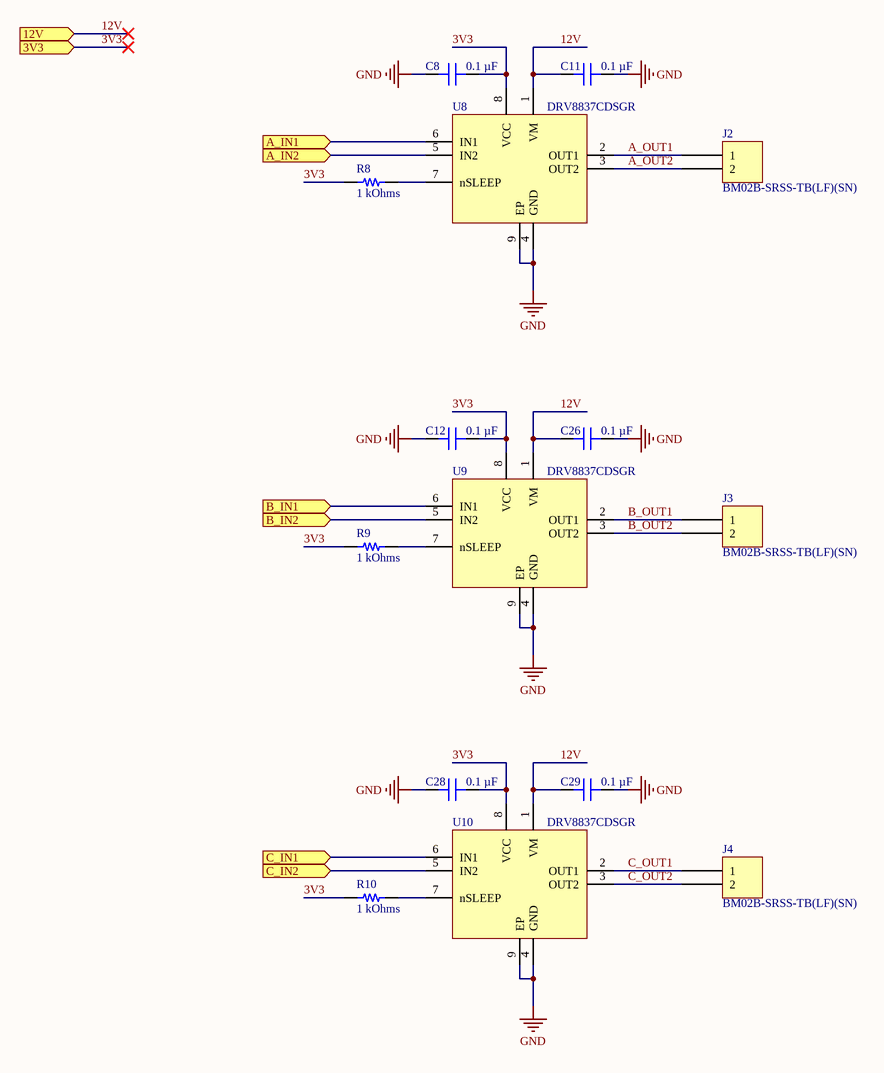
[diagram p4: HBridges.SchDoc]

### Parts
C8  0.1 µF  [CAP 0402_1005]
C11  0.1 µF  [CAP 0402_1005]
C12  0.1 µF  [CAP 0402_1005]
C26  0.1 µF  [CAP 0402_1005]
C28  0.1 µF  [CAP 0402_1005]
C29  0.1 µF  [CAP 0402_1005]
J2  BM02B-SRSS-TB(LF)(SN)  [JST BM02B-SRSS-TB]
J3  BM02B-SRSS-TB(LF)(SN)  [JST BM02B-SRSS-TB]
J4  BM02B-SRSS-TB(LF)(SN)  [JST BM02B-SRSS-TB]
R8  1 kOhms  [YAGEO RES 0402_1005]
R9  1 kOhms  [YAGEO RES 0402_1005]
R10  1 kOhms  [YAGEO RES 0402_1005]
U8  DRV8837CDSGR  [SON50P200X200X80-9N]
U9  DRV8837CDSGR  [SON50P200X200X80-9N]
U10  DRV8837CDSGR  [SON50P200X200X80-9N]

### Ports
3V3 (in), 12V (in), A_IN1 (in), A_IN2 (in), B_IN1 (in), B_IN2 (in), C_IN1 (in), C_IN2 (in)

### Nets
3V3: C8.1 C12.1 C28.1 R8.1 R9.1 R10.1 U8.8(VCC) U9.8(VCC) U10.8(VCC) ; port 3V3
12V: C11.2 C26.2 C29.2 U8.1(VM) U9.1(VM) U10.1(VM) ; port 12V  [project net VBAT]
GND: C8.2 C11.1 C12.2 C26.1 C28.2 C29.1 U8.4(GND) U8.9(EP) U9.4(GND) U9.9(EP) U10.4(GND) U10.9(EP)
A_OUT1: J2.1 U8.2(OUT1)
A_OUT2: J2.2 U8.3(OUT2)
B_OUT1: J3.1 U9.2(OUT1)
B_OUT2: J3.2 U9.3(OUT2)
C_OUT1: J4.1 U10.2(OUT1)
C_OUT2: J4.2 U10.3(OUT2)
MOTOR.A_IN1: U8.6(IN1) ; port A_IN1
MOTOR.A_IN2: U8.5(IN2) ; port A_IN2
MOTOR.B_IN1: U9.6(IN1) ; port B_IN1
MOTOR.B_IN2: U9.5(IN2) ; port B_IN2
MOTOR.C_IN1: U10.6(IN1) ; port C_IN1
MOTOR.C_IN2: U10.5(IN2) ; port C_IN2
NetR8_2: R8.2 U8.7(nSLEEP)
NetR9_2: R9.2 U9.7(nSLEEP)
NetR10_2: R10.2 U10.7(nSLEEP)

### Library data of the parts
C8 C11 C12 C26 C28 C29 = C0402C104K4RACAUTO: as C7 on sheet Top; Part Number: C0402C104K4RACAUTO; Value: 0.1 µF; Applications: Automotive, Bypass, Decoupling; Capacitance: 0.1 µF; componentlink1description: Datasheet; componentlink1url: https://api.kemet.com/component-edge/download/specsheet/C0402C104K4RACAUTO.pdf; componentlink2description: DigiKey Link; componentlink2url: https://www.digikey.com/en/products/detail/kemet/C0402C104K4RACAUTO/3314827; Device Package: 0402 (1005 Metric); lastupdated: 8/14/2022 9:05:51 PM; Lifecycle Status: Active; Minimum Order: 1; Mounting Type: Surface Mount, MLCC; Operating Temperature: -55°C ~ 125°C; Package / Case: 0402 (1005 Metric); packaging: TapeAndReel; partid: 3024; Part Status: Active; price: 0.01; Ratings: AEC-Q200; series: SMD Auto X7R; Size / Dimension: 0.039" L x 0.020" W (1.00mm x 0.50mm); Supplier 1: DigiKey; Supplier Part Number 1: 399-6828-1-ND; Temperature Coefficient: X7R; Thickness (Max): 0.022" (0.55mm); Voltage - Rated: 16V
J2-J4 = BM02B-SRSS-TB(LF)(SN): CONN HEADER SMD 2POS 1MM; Manufacturer: JST Sales America Inc.; Current Rating (Amps): 0.7A; Material Flammability Rating: UL94 V-0; Number of Positions: 2; Number of Positions Loaded: All; Pitch - Mating: 0.039" (1.00mm); Shrouding: Shrouded - 4 Wall; Style: Board to Cable/Wire; Voltage Rating: 50V; Part Number: BM02B-SRSS-TB(LF)(SN); ComponentLink1Description: Datasheet; ComponentLink1URL: http://www.jst-mfg.com/product/pdf/eng/eSR.pdf; ComponentLink2Description: DigiKey Link; ComponentLink2URL: http://digikey.com/product-detail/en/jst-sales-america-inc/BM02B-SRSS-TB-LF-SN/455-1788-1-ND/926859; Connector Type: Header; Contact Finish - Mating: Tin; Contact Finish - Post: Tin; Contact Material: Copper Alloy; Contact Shape: Square; Contact Type: Male Pin; Fastening Type: Push-Pull; Features: Solder Retention; Insulation Color: Natural; Insulation Height: 0.167" (4.25mm); Insulation Material: Polyamide (PA), Nylon; LastUpdated: 1/12/2020 10:11:04 PM; Lifecycle Status: Active; Minimum Order: 1; Mounting Type: Surface Mount; Number of Rows: 1; Operating Temperature: -25°C ~ 85°C; Packaging: TapeAndReel; PartId: 12; Part Status: Active; Price: 0.22; Series: SR; Supplier 1: DigiKey; Supplier Part Number 1: 455-1788-1-ND; Termination: Solder
R8-R10 = RC0402FR-071KL: as R5 on sheet Top; Part Number: RC0402FR-071KL; Value: 1 kOhms; ComponentLink1Description: Datasheet; ComponentLink1URL: https://www.yageo.com/upload/media/product/productsearch/datasheet/rchip/PYu-RC_Group_51_RoHS_L_10.pdf; ComponentLink2Description: DigiKey Link; ComponentLink2URL: https://www.digikey.com/en/products/detail/yageo/RC0402FR-071KL/726513; Composition: Thick Film; Device Package: 0402 (1005 Metric); Features: Moisture Resistant; Height - Seated (Max): 0.016" (0.40mm); LastUpdated: 7/25/2024 9:18:11 AM; Lifecycle Status: Active; Minimum Order: 1; Number of Terminations: 2; Operating Temperature: -55°C ~ 155°C; Package / Case: 0402 (1005 Metric); Packaging: CutTape; PartId: 17596; Part Status: Active; Price: 0.01; Resistance: 1 kOhms; Series: RC_L; Size / Dimension: 0.039" L x 0.020" W (1.00mm x 0.50mm); Supplier 1: DigiKey; Supplier Part Number 1: 311-1.00KLRCT-ND; Supplier Device Package: 0402; Tolerance: ±1%
U8-U10 = DRV8837CDSGR: 11-V, 1-A H-bridge motor driver 8-WSON -40 to 85; MF: Texas Instruments; Mouser-Purchase-URL: https://snapeda.com/shop?store=Mouser&id=617854; Value: *; DigiKey-Purchase-URL: https://snapeda.com/shop?store=DigiKey&id=617854; Package: WSON-8 Texas Instruments; Texas_Instruments-Purchase-URL: https://snapeda.com/shop?store=Texas+Instruments&id=617854; Price: None; MP: DRV8837CDSGR; SnapEDA_Link: https://www.snapeda.com/parts/DRV8837CDSGR/Texas%20Instruments/view-part/617854/?ref=snap; Availability: Good

## Sheet ESP32.SchDoc
size B; DocumentNumber: 4; SheetNumber: 6; SheetTotal: 7
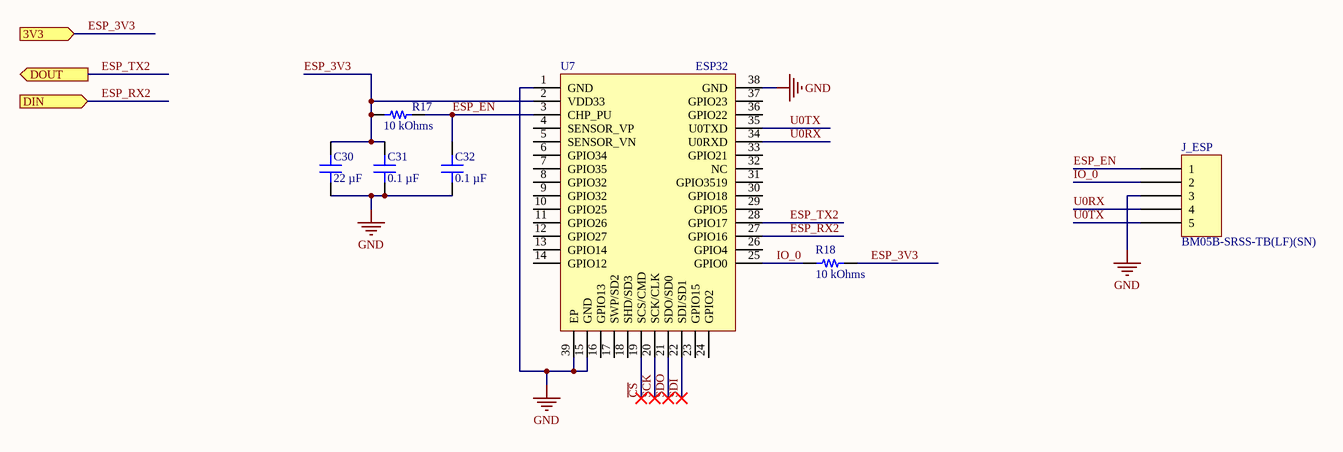
[diagram p5: ESP32.SchDoc]

### Parts
C30  22 µF  [CAP 0603_1608]
C31  0.1 µF  [CAP 0402_1005]
C32  0.1 µF  [CAP 0402_1005]
J_ESP  BM05B-SRSS-TB(LF)(SN)  [JST BM05B-SRSS-TB]
R17  10 kOhms  [RES 0402_1005]
R18  10 kOhms  [RES 0402_1005]
U7  ESP32  [Espressif ESP32-WROOM-32]

### Ports
3V3 (in), DIN (in), DOUT (out)

### Nets
ESP_3V3: C30.2 C31.2 R17.1 R18.2 U7.2(VDD33) ; port 3V3  [project net 3V3_ESP]
GND: C30.1 C31.1 C32.1 J_ESP.3 U7.1(GND) U7.15(GND) U7.38(GND) U7.39(EP)
~{CS}: U7.19(SCS/CMD)
ESP_EN: C32.2 J_ESP.1 R17.2 U7.3(CHP_PU)
ESP_RX2: U7.27(GPIO16) ; port DIN  [project net ESP_DIN]
ESP_TX2: U7.28(GPIO17) ; port DOUT  [project net ESP_DOUT]
IO_0: J_ESP.2 R18.1 U7.25(GPIO0)
SCK: U7.20(SCK/CLK)
SDI: U7.22(SDI/SD1)
SDO: U7.21(SDO/SD0)
U0RX: J_ESP.4 U7.34(U0RXD)
U0TX: J_ESP.5 U7.35(U0TXD)

Not connected (* = marked no-connect by the designer): U7 4(SENSOR_VP) 5(SENSOR_VN) 6(GPIO34) 7(GPIO35) 8(GPIO32) 9(GPIO32) 10(GPIO25) 11(GPIO26) 12(GPIO27) 13(GPIO14) 14(GPIO12) 16(GPIO13) 17(SWP/SD2) 18(SHD/SD3) 23(GPIO15) 24(GPIO2) 26(GPIO4) 29(GPIO5) 30(GPIO18) 31(GPIO3519) 32(NC) 33(GPIO21) 36(GPIO22) 37(GPIO23)

### Library data of the parts
C30 = C0603B476M007T: as C4 on sheet 5V_buck; Part Number: C0603B476M007T; Value: 22 µF; Applications: SMPS Filtering; componentlink1description: Datasheet; componentlink1url: https://media.digikey.com/pdf/Data%20Sheets/Holy%20Stone/HCC_Series_DS.pdf; componentlink2description: DigiKey Link; componentlink2url: https://www.digikey.com/en/products/detail/holy-stone-enterprise-co-ltd/C0603B476M007T/16895203; Device Package: 0603 (1608 Metric); lastupdated: 2/9/2024 8:09:41 PM; Lifecycle Status: Active; Minimum Order: 1; Mounting Type: Surface Mount, MLCC; Operating Temperature: -55°C ~ 85°C; Package / Case: 0603 (1608 Metric); packaging: TapeAndReel; partid: 48531; Part Status: Active; price: 0.12; series: HCC; Size / Dimension: 0.063" L x 0.031" W (1.60mm x 0.80mm); Supplier 1: DigiKey; Supplier Part Number 1: 4587-C0603B476M007TCT-ND; Temperature Coefficient: X5R; Thickness (Max): 0.039" (1.00mm); Voltage - Rated: 6.3V
C31 C32 = C1005X5R1E104K050BC: CAP CER 0.1UF 25V X5R 0402; manufacturer: TDK Corporation; Tolerance: ±10%; Part Number: C1005X5R1E104K050BC; Value: 0.1 µF; Applications: General Purpose; Capacitance: 0.1 µF; componentlink1description: Datasheet; componentlink1url: https://product.tdk.com/info/en/catalog/datasheets/mlcc_commercial_general_en.pdf?ref_disty=digikey; componentlink2description: DigiKey Link; componentlink2url: https://www.digikey.com/en/products/detail/tdk-corporation/C1005X5R1E104K050BC/2093232; Device Package: 0402 (1005 Metric); Features: Low ESL; lastupdated: 9/24/2023 7:03:59 PM; Lifecycle Status: Active; Minimum Order: 1; Mounting Type: Surface Mount, MLCC; Operating Temperature: -55°C ~ 85°C; Package / Case: 0402 (1005 Metric); packaging: TapeAndReel; partid: 34396; Part Status: Active; price: 0.01; series: C; Size / Dimension: 0.039" L x 0.020" W (1.00mm x 0.50mm); Supplier 1: DigiKey; Supplier Part Number 1: 445-4964-1-ND; Temperature Coefficient: X5R; Thickness (Max): 0.022" (0.55mm); Voltage - Rated: 25V
J_ESP = BM05B-SRSS-TB(LF)(SN): as ICSP1 on sheet PIC32MZ; Part Number: BM05B-SRSS-TB(LF)(SN); ComponentLink1Description: Datasheet; ComponentLink1URL: http://www.jst-mfg.com/product/pdf/eng/eSR.pdf; ComponentLink2Description: DigiKey Link; ComponentLink2URL: http://digikey.com/product-detail/en/jst-sales-america-inc/BM05B-SRSS-TB-LF-SN/455-1791-1-ND/926862; Connector Type: Header; Contact Finish - Mating: Tin; Contact Finish - Post: Tin; Contact Material: Copper Alloy; Contact Shape: Square; Contact Type: Male Pin; Fastening Type: Push-Pull; Features: Solder Retention; Insulation Color: Natural; Insulation Height: 0.167" (4.25mm); Insulation Material: Polyamide (PA), Nylon; LastUpdated: 1/12/2020 10:14:00 PM; Lifecycle Status: Active; Minimum Order: 1; Mounting Type: Surface Mount; Number of Rows: 1; Operating Temperature: -25°C ~ 85°C; Packaging: TapeAndReel; PartId: 18; Part Status: Active; Price: 0.35; Series: SR; Supplier 1: DigiKey; Supplier Part Number 1: 455-1791-1-ND; Termination: Solder
R17 R18 = CRCW040210K0DHEDP: RES SMD 10K OHM 0.5% 1/16W 0402; Manufacturer: Vishay Dale; Power (Watts): 0.063W, 1/16W; Temperature Coefficient: ±50ppm/°C; Part Number: CRCW040210K0DHEDP; Value: 10 kOhms; ComponentLink1Description: Datasheet; ComponentLink1URL: http://www.vishay.com/docs/20036/dcrcwpe3.pdf; ComponentLink2Description: DigiKey Link; ComponentLink2URL: https://www.digikey.com/en/products/detail/vishay-dale/CRCW040210K0DHEDP/3593893; Composition: Thick Film; Device Package: 0402 (1005 Metric); Features: Automotive AEC-Q200; Height - Seated (Max): 0.016" (0.40mm); LastUpdated: 9/24/2023 7:25:38 PM; Lifecycle Status: Active; Minimum Order: 1; Number of Terminations: 2; Operating Temperature: -55°C ~ 155°C; Package / Case: 0402 (1005 Metric); Packaging: TapeAndReel; PartId: 5057; Part Status: Active; Price: 0.03; Ratings: AEC-Q200; Resistance: 10 kOhms; Series: CRCW-P; Size / Dimension: 0.039" L x 0.020" W (1.00mm x 0.50mm); Supplier 1: DigiKey; Supplier Part Number 1: 541-10KAVCT-ND; Supplier Device Package: 0402; Tolerance: ±0.5%

## Nets that join several sheets
3V3: U_3V3_LDO (C10_4.2 U5_1.1), HBridges (9 pins)
3V3_ESP: U_3V3_LDO (C10_1.2 U5_4.1), ESP32 (5 pins)
3V3_IMU: Top (9 pins), U_3V3_LDO (C10_2.2 U5_3.1)
3V3_XBee: Top (C6.1 U2.2), U_3V3_LDO (C10_3.2 U5_2.1)
5V: Top (R5.1), 5V_buck (C2.2 C3.2 L1.2 U4.1), U_3V3_LDO (C9_4.2 R16_4.1 U5_1.4), U_3V3_LDO (C9_3.2 R16_3.1 U5_2.4), U_3V3_LDO (C9_2.2 R16_2.1 U5_3.4), U_3V3_LDO (C9_1.2 R16_1.1 U5_4.4)
GND: Top (26 pins), PIC32MZ (29 pins), 5V_buck (5 pins), U_3V3_LDO (C9_4.1 C10_4.1 U5_1.2 U5_1.5), U_3V3_LDO (C9_3.1 C10_3.1 U5_2.2 U5_2.5), U_3V3_LDO (C9_2.1 C10_2.1 U5_3.2 U5_3.5), U_3V3_LDO (C9_1.1 C10_1.1 U5_4.2 U5_4.5), HBridges (12 pins), ESP32 (8 pins)
VBAT: Top (C16.1 P1.2), 5V_buck (C4.2 C5.2 U4.2 U4.3), HBridges (6 pins)
ESP_DIN: PIC32MZ (R14.1), ESP32 (U7.27)
ESP_DOUT: PIC32MZ (R15.1), ESP32 (U7.28)
SCL: Top (U3.23 U6.1), PIC32MZ (U1.42)
SDA: Top (U3.24 U6.11), PIC32MZ (U1.41)
XBEE_DIN: Top (U2.4), PIC32MZ (R6.2)
XBEE_DOUT: Top (U2.3), PIC32MZ (R7.2)

## Assembly variants
Main: not fitted R25 R26